# Altium schematic sheet CellVoltageControl.SchDoc
size A4; SheetNumber: 1; SheetTotal: 7
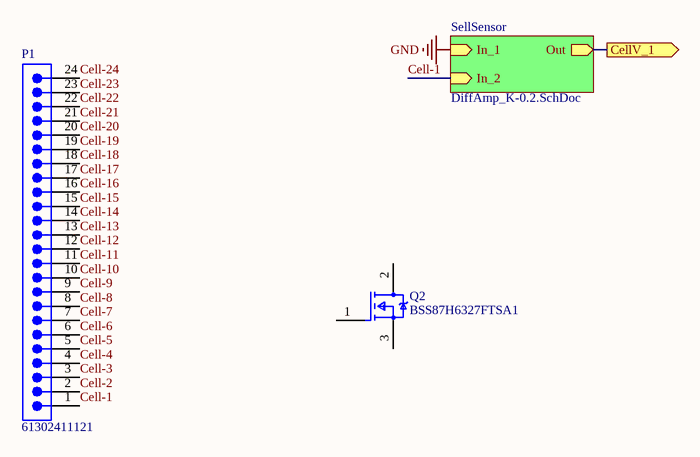
[diagram p0: CellVoltageControl.SchDoc]

## Parts
P1  61302411121  [61302411121]
Q2  BSS87H6327FTSA1  [FP-PG-SOT89-4-MFG]

## Sub-sheets
SellSensor = DiffAmp_K-0.2.SchDoc: Out (out), In_2 (in), In_1 (in)

## Ports
CellV_1 (out)

## Nets
GND: sheet SellSensor/In_1
Cell-1: P1.1 ; sheet SellSensor/In_2
Cell-2: P1.2
Cell-3: P1.3
Cell-4: P1.4
Cell-5: P1.5
Cell-6: P1.6
Cell-7: P1.7
Cell-8: P1.8
Cell-9: P1.9
Cell-10: P1.10
Cell-11: P1.11
Cell-12: P1.12
Cell-13: P1.13
Cell-14: P1.14
Cell-15: P1.15
Cell-16: P1.16
Cell-17: P1.17
Cell-18: P1.18
Cell-19: P1.19
Cell-20: P1.20
Cell-21: P1.21
Cell-22: P1.22
Cell-23: P1.23
Cell-24: P1.24
CellV_1: port CellV_1, sheet SellSensor/Out

Not connected (* = marked no-connect by the designer): Q2 1(Gate) 2(Drain) 3(Source)

## Library data of the parts
P1 = CMP-1502-01109-3: NexarPartId: 32855561; Pitch: 2.54mm; Contact Resistance: 20mΩ; Operating Supply Voltage: 250V; Current Rating: 3A; Gender: Male; Connector Type: Male Pin; Number of Positions: 24; Packaging: Bulk; Lead Pitch: 2.54mm; Number of Pins: 24; Orientation: Vertical; Contact Material: Copper; REACH SVHC: Unknown; Color: Black; Mount: Through Hole; Contact Plating: Gold; Contact Mating Length: 5.9944mm; RoHS: Compliant; Termination: Solder; Number of Rows: 1; Number of Contacts: 24
Q2 = CMP-32901-001322-1: MOSFET N-CH 240V 260MA SOT89-4; Input Capacitance: 97pF; Drain to Source Resistance: 3.9R; Rise Time: 3.5ns; Rds On Max: 6R; Fall Time: 27.3ns; Turn-On Delay Time: 3.7ns; Number of Elements: 1; Power Dissipation: 1W; Element Configuration: Single; Gate to Source Voltage (Vgs): 20V; Polarity: N-CHANNEL; Turn-Off Delay Time: 17.6ns; Case/Package: SOT-89; Max Dual Supply Voltage: 240V; Drain to Source Voltage (Vdss): 240V; Lead Free: Lead Free; Package Quantity: 1000; Halogen Free: Not Halogen Free; RoHS Compliant: Yes; Width: 2.5mm; Length: 4.5mm; Mount: Surface Mount; Packaging: Tape and Reel; Max Power Dissipation: 1W; Height: 1.5mm; Max Operating Temperature: 150°C; Series: SIPMOS®; Drain to Source Breakdown Voltage: 240V; Min Operating Temperature: -55°C; Number of Pins: 3; Continuous Drain Current (ID): 260mA